# Altium schematic sheet PowerCard.SchDoc
size Letter; SheetNumber: 1; SheetTotal: 3
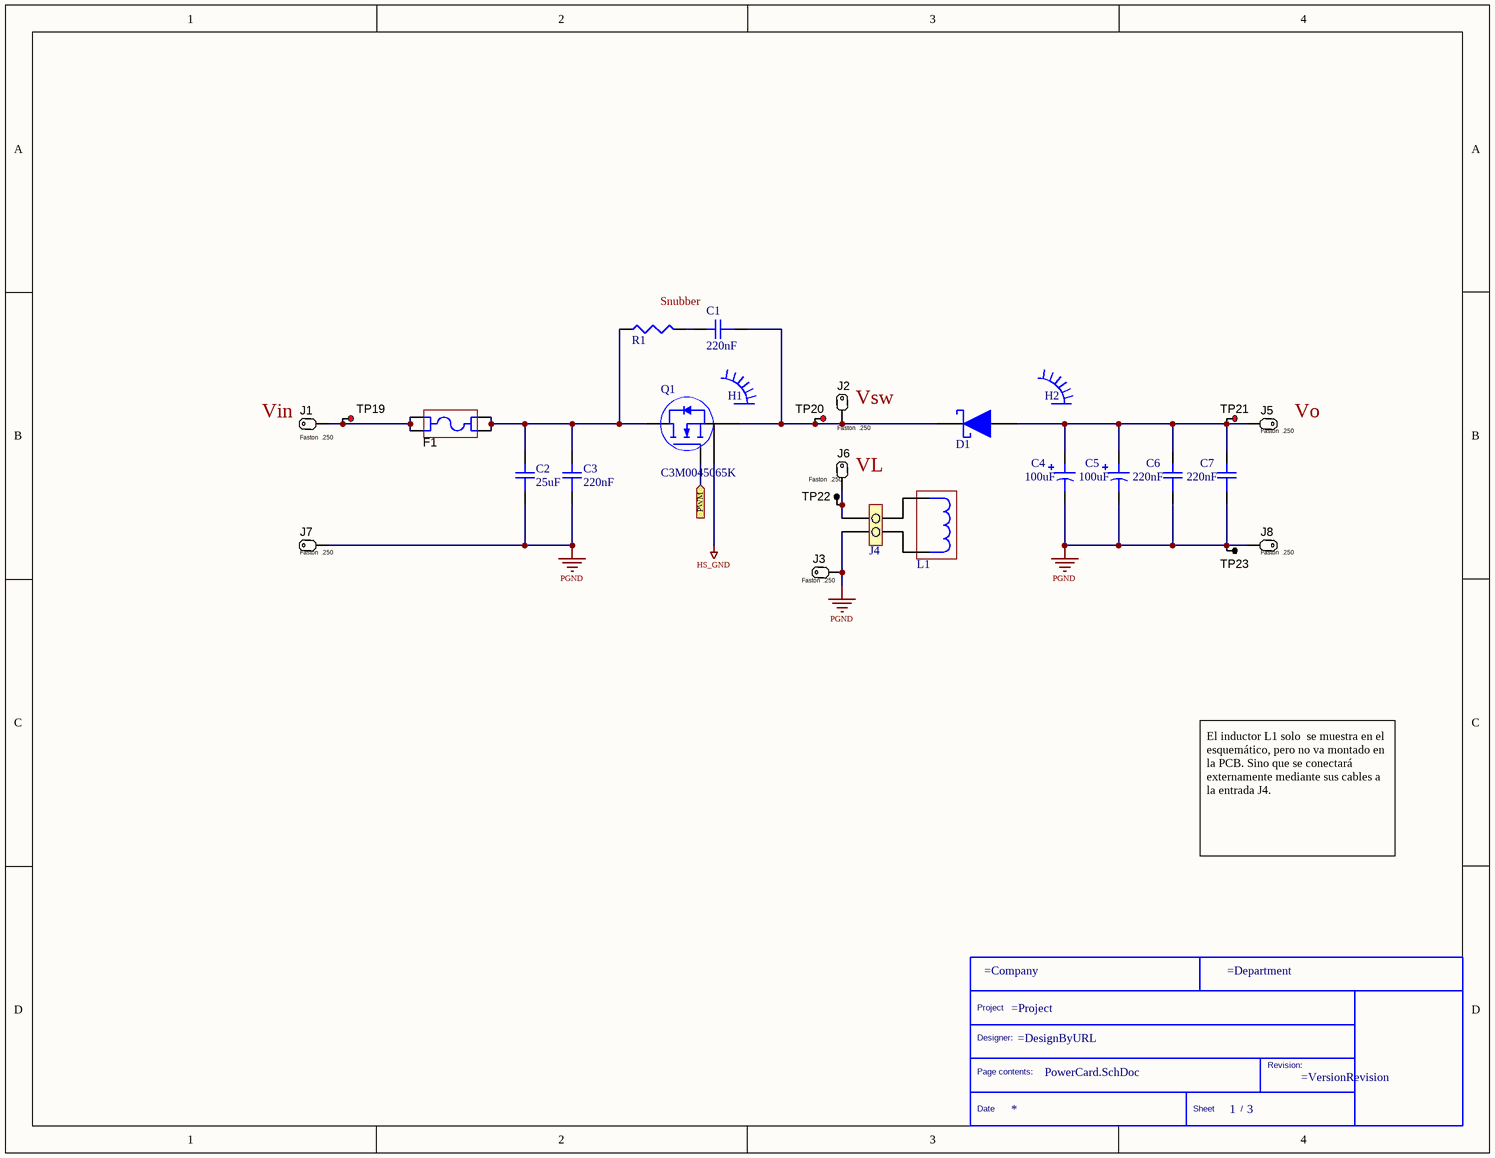
[diagram p0: PowerCard.SchDoc]

## Parts
*  TittleBlock  (value not drawn)  (graphical)
C1  220nF  [R75PI32204030J]
C2  25uF  [C4AQLBU5250A12K]
C3  220nF  [R75PI32204030J]
C4  100uF  [CAP_MXC_22x35_RUB]
C5  100uF  [CAP_MXC_22x35_RUB]
C6  220nF  [R75PI32204030J]
C7  220nF  [R75PI32204030J]
D1  Schottky Diode  [C6D06065A]  (value not drawn)
F1  3101.0040  [SCHURTER_3101_0040]  (value not drawn)
H1  Disipador de 3.3.C/W  [HSINK_6399BG]  (value not drawn)
H2  Disipador de 3.3.C/W  [HSINK_6399BG]  (value not drawn)
J1  Faston  .250  [TE_62409-1]
J2  Faston  .250  [TE_62409-1]
J3  Faston  .250  [TE_62409-1]
J4  2P Terminal,  12-20  AWG  [TE_8PCV-02-006]  (value not drawn)
J5  Faston  .250  [TE_62409-1]
J6  Faston  .250  [TE_62409-1]
J7  Faston  .250  [TE_62409-1]
J8  Faston  .250  [TE_62409-1]
L1  Inductor is not mounted on PCB  (value not drawn)  (mechanical)
Q1  C3M0045065K  [TO-247-4L_C3M0075120K_WFS]
R1  Wirewound, Snubber  [Wirewound Resistors 47 Ohms 7W 300PPM]  (value not drawn)
TP19  5010  [Keystone5010]  (value not drawn)
TP20  5010  [Keystone5010]  (value not drawn)
TP21  5010  [Keystone5010]  (value not drawn)
TP22  5011  [Keystone5011]  (value not drawn)
TP23  5011  [Keystone5011]  (value not drawn)

## Ports
PWM (in)

## Nets
HS_GND: Q1.3(S)
PGND: C2.2 C3.2 C4.2 C5.2 C6.2 C7.2 J3.1(P1) J4.1 J7.1(P1) J8.1(P1) TP23.1
PWM: Q1.4(G) ; port PWM
NetC1_1: C1.1 R1.2
NetC1_2: C1.2 D1.1 J2.1(P1) Q1.2(Power_Source) TP20.1
NetC2_1: C2.1 C3.1 F1.3 F1.4 Q1.1(D) R1.1
NetC4_1: C4.1 C5.1 C6.1 C7.1 D1.2 J5.1(P1) TP21.1
NetF1_1: F1.1 F1.2 J1.1(P1) TP19.1
NetJ4_2: J4.2 J6.1(P1) TP22.1

Not connected (* = marked no-connect by the designer): L1 1 2

## Notes on the sheet
- Snubber
- (near J1) Vin
- (near J2) Vsw
- (near J5) Vo
- (near J6) VL
- El inductor L1 solo  se muestra en el esquemático, pero no va montado en la PCB. Sino que se conectará externamente mediante sus cables a la entrada J4.
- (in symbol TittleBlock) Project; Designer:; Page contents:; Revision:; Date; Sheet; /

## Library data of the parts
* = TittleBlock: Standard Title block
C1 C3 C6 C7 = R75PI32204030J: KEMET         R75PI32204030J            Film Capacitor, AEC-Q200 R75 Series, 0.22 F,  5%, PP (Polypropylene), 630 V; Voltage Rating: 630V; Voltage Rating (AC): 250V; Dissipation Factor: 0.05%; Lead Diameter: 0.8mm; Lead Length: 30mm; Supplier 1: Digi-Key; Supplier Part Number 1: 399-12761-ND; Manufacturer: KEMET; Manufacturer Part Number: R75PI32204030J; RoHS: Yes; Category: Film Capacitors; Stock 1: 488; Pricing 1: 1=0,95000, 10=0,72000, 50=0,59800, 100=0,51490, 500=0,39860, 1000=0,34324, 2500=0,32110, 5000=0,31002 (USD); Mount: Through Hole; Case/Package: Radial; Dielectric Material: PP; Min Operating Temperature: -55°C; Max Operating Temperature: 105°C; Capacitance: 220nF; Tolerance: 5%; Packaging: Bulk; Voltage Rating (DC): 630V; Dielectric: PP; Termination: PC Pins; Voltage: 630V; Length: 0.709inch; Width: 0.394inch; Height: 16mm; Height - Seated (Max): 0.634inch; Lead Pitch: 15mm; Depth: 10mm; REACH SVHC: No SVHC; RoHS Compliant: Yes; ComponentLink1URL: http://www.alliedelec.com/m/d/0659d349de7ca29105b1b70da899f791.pdf?src-supplier=Allied+Electronics; ComponentLink1Description: http://www.alliedelec.com/m/d/0659d349de7ca29105b1b70da899f791.pdf?src-supplier=Allied+Electronics; ComponentLink2URL: http://www.farnell.com/datasheets/2120989.pdf?src-supplier=Farnell; ComponentLink2Description: http://www.farnell.com/datasheets/2120989.pdf?src-supplier=Farnell; ComponentLink3URL: http://www.kemet.com/docfinder?Partnumber=R75PI32204030J&src-supplier=Digi-Key; ComponentLink3Description: http://www.kemet.com/docfinder?Partnumber=R75PI32204030J&src-supplier=Digi-Key; ComponentLink4URL: http://www.farnell.com/datasheets/2068064.pdf?src-supplier=Element14; ComponentLink4Description: http://www.farnell.com/datasheets/2068064.pdf?src-supplier=Element14
C2 = C4AQLBU5250A12K: KEMET   C4AQLBU5250A12K.   CAP FILM 25UF 10% 500VDC RADIAL; Supplier 1: Digi-Key; Supplier Part Number 1: 399-16989-ND; Manufacturer: KEMET; Manufacturer Part Number: C4AQLBU5250A12K; RoHS: Yes; Category: Film Capacitors; Stock 1: 99; Pricing 1: 1=7,00000, 10=6,21800, 50=5,44060, 100=4,97440, 500=4,35256 (USD); RoHS Compliant: Yes; Value: 25uF
C4 C5 = 475MXH100MEFCSN22X35: Cap Aluminum Lytic 100uF 475V 20% (22 X 35mm) Snap-In 10mm 880mA 2000h 105C; Manufacturer: Rubycon; Polarity: Polar; Life (Hours): 2000Hour; Supplier 1: Digi-Key; Supplier Part Number 1: 1189-3424-ND; Manufacturer Part Number: 475MXH100MEFCSN22X35; RoHS: Yes; Category: Aluminum Electrolytic Capacitors; Stock 1: 187; Pricing 1: 1=3,65000, 10=3,53900, 50=3,13740, 100=2,84560, 500=2,11598, 1000=1,97004, 2500=1,89708, 5000=1,86059 (USD); Mount: Through Hole; Case/Package: Radial; Min Operating Temperature: -25°C; Max Operating Temperature: 105°C; Packaging: Bulk; Capacitance: 100uF; Voltage Rating: 475V; Ripple Current: 880mA; Tolerance: 20%; Lead Pitch: 0.394inch; Height - Seated (Max): 1.457inch; RoHS Compliant: Yes; ComponentLink1URL: http://www.rubycon.co.jp/en/catalog/e_pdfs/aluminum/e_MXH.pdf?src-supplier=Digi-Key; ComponentLink1Description: http://www.rubycon.co.jp/en/catalog/e_pdfs/aluminum/e_MXH.pdf?src-supplier=Digi-Key
D1 = C6D06065A: Sic Schottky Diode, VRRM = 650V. IF= 6A; Manufacturer: Cree Wolfspeed; Cagetory: Schottly Diode; Supplier 1: Digi-Key; Supplier Part Number 1: 1697-C6D06065A-ND; Manufacturer Part Number: C6D06065A; RoHS: No; Stock 1: 376; Pricing 1: 1=1,80000 (USD)
F1 = 3101.0040: Fuse Holder, 400 V, 16 A, TH; Manufacturer: Schurter; SymbolCreator: a0799628; SymbolVersion: 2014-05-01; CompType: Fuse Holder; PartNumber: 3101.0040; RoHS: Y; PackageReference: Fuse Holder for 5x20mm; MountType: TH; ComponentLink1Description: Datasheet Link; ComponentLink1URL: http://www.schurterinc.com/var/schurter/storage/ilcatalogue/files/document/datasheet/en/pdf/typ_FPG4.pdf; Publisher: Texas Instruments; LatestRevisionDate: 2016-05-10; Supplier 1: Digi-Key; Supplier Part Number 1: 486-1159-ND
H1 H2 = 6399BG: AAVID THERMALLOY         6399BG            Heat Sink, TO-220/218, TO-220, 3.3 C/W, 50 mm, 41.91 mm, 25.4 mm; Finish: Anodized; Natural Thermal Resistance: 3.3°C/W; Supplier 1: Digi-Key; Supplier Part Number 1: HS528-ND; Manufacturer: Aavid Thermalloy; Manufacturer Part Number: 6399BG; RoHS: Yes; Category: Heat Sinks; Stock 1: 1442; Pricing 1: 1=6,20000, 10=6,02800, 25=5,69320, 50=5,35840, 100=5,02350, 250=4,68860, 500=4,35370, 1000=4,26998, 5000=4,18625 (USD); Case/Package: TO-220; Color: Black; Material: Anodized; Type: Passive; Package Quantity: 250; Series: *; Length: 41.91mm; Width: 41.91mm; Height: 50.8mm; Depth: 25.4mm; Radiation Hardening: No; REACH SVHC: No SVHC; Lead Free: Lead Free; RoHS Compliant: Yes; ComponentLink1URL: https://datasheet.ciiva.com/26826/getdatasheetpartid-556672-26826808.pdf?src-supplier=Verical; ComponentLink1Description: https://datasheet.ciiva.com/26826/getdatasheetpartid-556672-26826808.pdf?src-supplier=Verical; ComponentLink2URL: https://datasheet.ciiva.com/16401/aavid20thermalloy206399bg-16401195.pdf?src-supplier=Future+Electronics; ComponentLink2Description: https://datasheet.ciiva.com/16401/aavid20thermalloy206399bg-16401195.pdf?src-supplier=Future+Electronics
J1-J3 J5-J8 = 62409-1: Quick Disconnect Terminal M 15.8mm 7.5mm Tin Over Copper Automotive Bag; Manufacturer: AMP - TE CONNECTIVITY; Supplier 1: Digi-Key; Supplier Part Number 1: A24742-ND; Manufacturer Part Number: 62409-1; RoHS: No; Stock 1: 8729; Pricing 1: 1=0,19000, 10=0,17800, 25=0,15200, 50=0,13320, 100=0,12360, 250=0,10936, 750=0,09035, 1500=0,08083, 8000=0,06895 (USD); ComponentLink1URL: http://www.farnell.com/datasheets/1650963.pdf?src-supplier=Farnell; ComponentLink1Description: http://www.farnell.com/datasheets/1650963.pdf?src-supplier=Farnell; ComponentLink2URL: http://www.farnell.com/datasheets/1650963.pdf?src-supplier=Element14; ComponentLink2Description: http://www.farnell.com/datasheets/1650963.pdf?src-supplier=Element14; ComponentLink3URL: http://www.farnell.com/datasheets/1650963.pdf?src-supplier=Newark; ComponentLink3Description: http://www.farnell.com/datasheets/1650963.pdf?src-supplier=Newark; ComponentLink4URL: https://www.te.com/commerce/DocumentDelivery/DDEController?Action=srchrtrv&DocNm=62409&DocType=Customer+Drawing&DocLang=English&src-supplier=Digi-Key; ComponentLink4Description: https://www.te.com/commerce/DocumentDelivery/DDEController?Action=srchrtrv&DocNm=62409&DocType=Customer+Drawing&DocLang=English&src-supplier=Digi-Key
J4 = 8PCV-02-006: Barrier Terminal Blocks VERTICAL RAISED 2P; Manufacturer: TE Connectivity; Max Voltage Rating (AC): 600V; Current Rating: 30A; Number of Contacts: 2; Mounting Ears: No (Without); Number of Levels: 1; Wire Gauge (Max): 18AWG; Wire Gauge (Min): 10AWG; Pitch: 11.1mm; Thread Size: M4; Supplier 1: Digi-Key; Supplier Part Number 1: A98460-ND; Manufacturer Part Number: 8PCV-02-006; RoHS: Yes; Category: Terminal Blocks; Stock 1: 4811; Pricing 1: 1=1,84000, 10=1,29200, 25=1,20480, 50=1,09360, 100=1,08880, 250=0,91940, 500=0,87102, 1000=0,77424, 5000=0,62907 (USD); Mount: Through Hole; Contact Material: Copper Alloy; Contact Plating: Tin; Color: Black; Housing Material: Thermoplastic; Terminal Material: Copper Alloy; Insulation Material: Thermoplastic; Material: Thermoplastic; Min Operating Temperature: -40°C; Max Operating Temperature: 248°C; Number of Rows: 1; Voltage Rating: 600V; Package Quantity: 270; Termination: Screw; Number of Circuits: 2; Orientation: Straight; Number of Wire Entries: 2; Number of Positions: 2; Max Current Rating: 30A; Mounting Insert: No (Without); Voltage: 600V; Series: #8, Buchanan; Length: 24.07mm; Width: 0.8inch; Height: 0.77inch; Depth: 0.77inch; Wire/Cable Gauge: 10AWG; Flammability Rating: UL94 V-0; ELV: Compliant; RoHS Compliant: Yes; ComponentLink1URL: https://datasheet.ciiva.com/30214/8pcv02006-30214903.pdf?src-supplier=Onlinecomponents.com; ComponentLink1Description: https://datasheet.ciiva.com/30214/8pcv02006-30214903.pdf?src-supplier=Onlinecomponents.com; ComponentLink2URL: https://datasheet.ciiva.com/11746/0900766b80fa362c-11746107.pdf?src-supplier=RSComponents; ComponentLink2Description: https://datasheet.ciiva.com/11746/0900766b80fa362c-11746107.pdf?src-supplier=RSComponents; ComponentLink3URL: https://datasheet.ciiva.com/5181/eng-cd-6-1437657-3-k4-5181165.pdf?src-supplier=Mouser; ComponentLink3Description: https://datasheet.ciiva.com/5181/eng-cd-6-1437657-3-k4-5181165.pdf?src-supplier=Mouser
L1 = 195J10: Fixed Inductors CHOKE; Manufacturer: Hammond Manufacturing; Shielding: Unshielded; Tolerance: 15%; Current Rating: 10A; Inductance: 10mH; DC Resistance (DCR): 70mR; Supplier 1: Digi-Key; Supplier Part Number 1: HM2135-ND; Manufacturer Part Number: 195J10; RoHS: Yes; Category: Fixed Inductors; Stock 1: 6; Pricing 1: 1=68,56000, 10=65,13000 (USD); Mount: Chassis Mount; Case/Package: Nonstandard; Weight: 6.5lb; Package Quantity: 1; Packaging: Bulk; Max DC Current: 10A; Termination: Screw; Series: 195; Length: 3.75inch; Width: 4.35inch; Height: 3.13inch; Height - Seated (Max): 3.13inch; Lead Free: Lead Free; RoHS Compliant: Yes; ComponentLink1URL: https://www.alliedelec.com/m/d/8463d4499fe931fd0b51c89e75ad4eff.pdf?src-supplier=Allied+Electronics; ComponentLink1Description: https://www.alliedelec.com/m/d/8463d4499fe931fd0b51c89e75ad4eff.pdf?src-supplier=Allied+Electronics; ComponentLink2URL: http://www.mouser.com/ds/2/177/5c0034-44711.pdf?src-supplier=Mouser; ComponentLink2Description: http://www.mouser.com/ds/2/177/5c0034-44711.pdf?src-supplier=Mouser; ComponentLink3URL: https://www.hammfg.com/electronics/transformers/choke/195-196.pdf?src-supplier=Digi-Key; ComponentLink3Description: https://www.hammfg.com/electronics/transformers/choke/195-196.pdf?src-supplier=Digi-Key
Q1 = C3M0045065K: Sic MOSFET 650V; Manufacturer: Cree Wolfspeed; Supplier 1: DigiKey; Supplier Part Number 1: 1697-C3M0045065K-ND; Manufacturer Part Number: C3M0045065K; RoHS: No; Stock 1: 444; Pricing 1: 1=10,55000 (USD); Supplier 2: Digi-Key; Supplier Part Number 2: 1697-C3M0045065K-ND
R1 = SQMW747RJ: Wirewound Resistors 47 Ohms 7W 300PPM; Manufacturer: TE Connectivity; Tolerance: 5%; Resistance: 47R; Temperature Coefficient: 300ppm/°C; Voltage Rating: 500V; Number of Resistors: 1; Lead Length: 3.5mm; Supplier 1: Digi-Key; Supplier Part Number 1: A102485-ND; Manufacturer Part Number: SQMW747RJ; RoHS: Yes; Category: Through-Hole Resistors; Stock 1: 6233; Pricing 1: 1=0,69000, 10=0,57500, 25=0,49240, 50=0,44320, 100=0,38580, 250=0,34472, 500=0,27908, 1000=0,22572, 5000=0,21833 (USD); Mount: Radial; Case/Package: Radial; Min Operating Temperature: -55°C; Max Operating Temperature: 250°C; Power Rating: 7W; Resistor Type: Wirewound,Power resistor; Packaging: Loose Piece; Package Quantity: 250; Termination: Radial; Number of Terminations: 2; Features: Moisture Resistant; Series: SQ, CGS; Max Power Dissipation: 7W; Resistance Tolerance: 5%; Technology: WIRE WOUND; Length: 39mm; Width: 13mm; Height: 9mm; Lead Pitch: 5mm; Depth: 9mm; RoHS Compliant: Yes; REACH SVHC: No SVHC; ELV: Compliant; ComponentLink1URL: https://datasheet.ciiva.com/16761/70063865-16761751.pdf?src-supplier=Allied+Electronics; ComponentLink1Description: https://datasheet.ciiva.com/16761/70063865-16761751.pdf?src-supplier=Allied+Electronics; ComponentLink2URL: https://datasheet.ciiva.com/7716/1468561-7716282.pdf?src-supplier=Element14; ComponentLink2Description: https://datasheet.ciiva.com/7716/1468561-7716282.pdf?src-supplier=Element14
TP19-TP21 = 5010: Test Point, Multipurpose, Red, TH; Manufacturer: Keystone; CompType: Test Point Loop; ContactFinish: Silver; SymbolVersion: 2008-04-04; PartNumber: 5010; PackageReference: Red Multipurpose Testpoint; RoHS: Y; MountType: TH; ComponentLink1Description: Datasheet URL; ComponentLink1URL: http://www.keyelco.com/userAssets/file/M60-2p60.pdf; Color: Red; Publisher: Texas Instruments; LatestRevisionDate: 2016-02-11; Supplier 1: Digi-Key; Supplier Part Number 1: 36-5010-ND; Supplier 2: Mouser; Supplier Part Number 2: 534-5010
TP22 TP23 = 5011: Test Point, Multipurpose, Black, TH; Manufacturer: Keystone; CompType: Test Point Loop; ContactFinish: Silver; SymbolVersion: 2008-04-04; PartNumber: 5011; PackageReference: Black Multipurpose Testpoint; RoHS: Y; MountType: TH; ComponentLink1Description: Datasheet URL; ComponentLink1URL: http://www.keyelco.com/userAssets/file/M60-2p60.pdf; Color: Black; Publisher: Texas Instruments; LatestRevisionDate: 2016-02-11; Supplier 1: Digi-Key; Supplier Part Number 1: 36-5011-ND; Supplier 2: Mouser; Supplier Part Number 2: 534-5011